# EAGLE schematic HenHouseController (EAGLE 8.0.2)
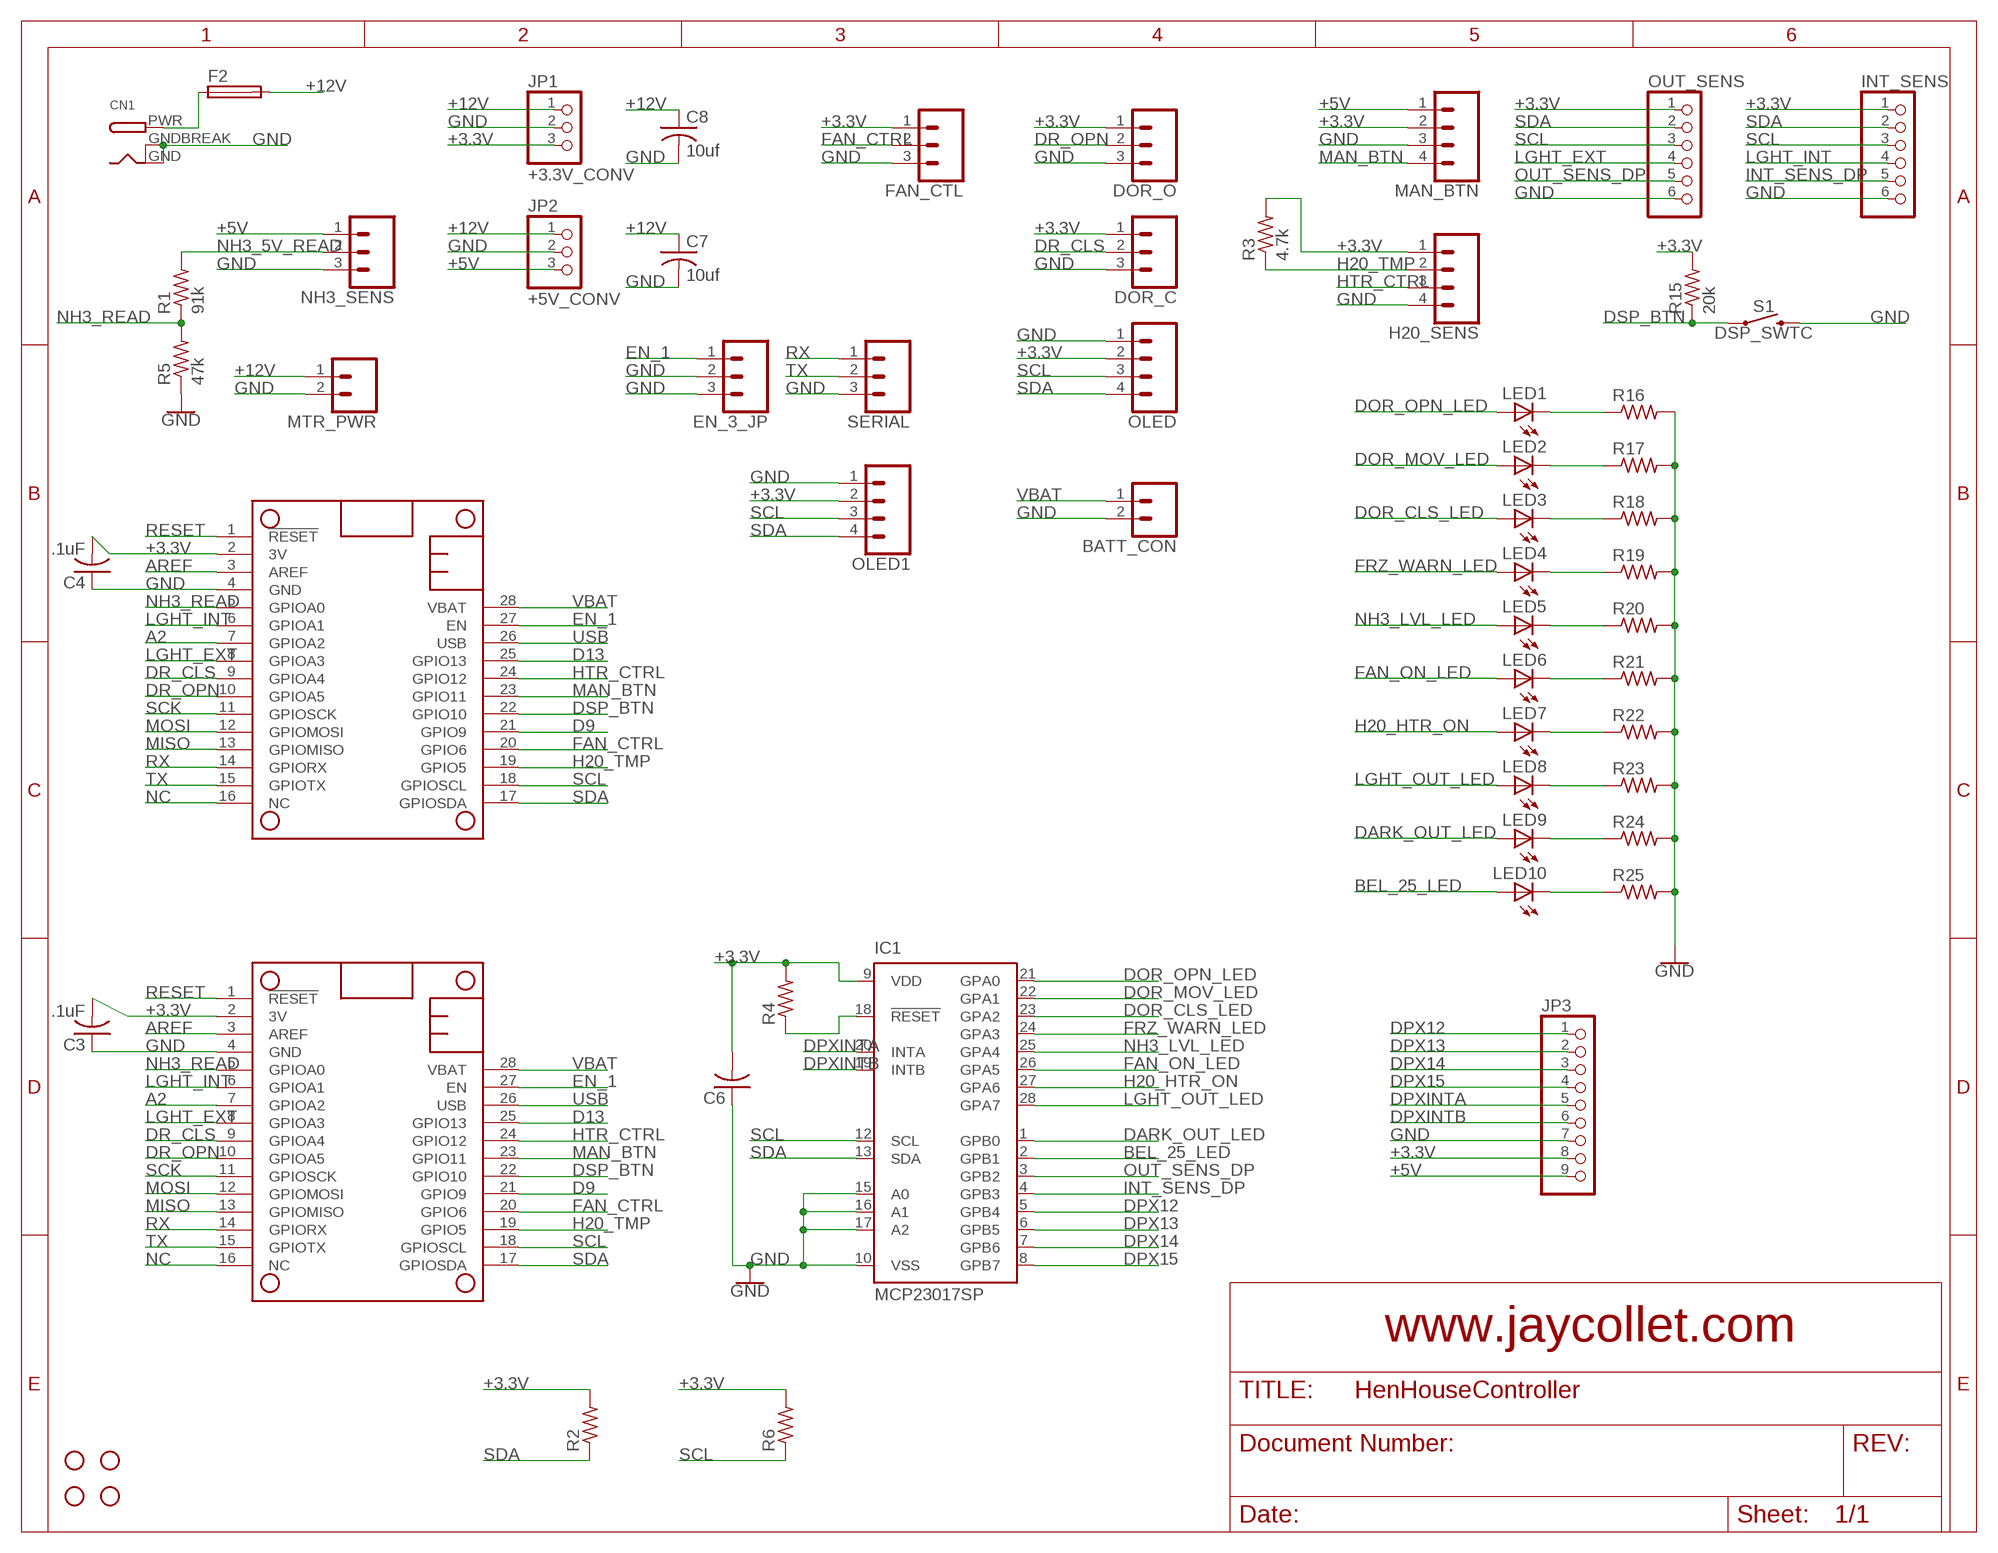
[diagram p0: schematic, sheet 1]

## Parts
BATT_CON  CONN_02  [1X02]
C3  .1uF  C-USC0805  [C0805]
C4  .1uF  C-USC0805  [C0805]
C6  C-USC0805  [C0805]
C7  10uf  C-USC0805  [C0805]
C8  10uf  C-USC0805  [C0805]
CN1  DCBARRELPTH  [DCJACK_2MM_PTH]
DOR_C  CONN_03  [1X03]
DOR_O  CONN_03  [1X03]
EN_3_JP  CONN_03  [1X03]
F2  SH25  [SH25]
FAN_CTL  CONN_03  [1X03]
FEATHER_1  FEATHERWING_NODIM  [FEATHERWING_DIM]
FEATHER_2  FEATHERWING_NODIM  [FEATHERWING_DIM]
H1  STAND-OFF  [STAND-OFF]
H2  STAND-OFF  [STAND-OFF]
H3  STAND-OFF  [STAND-OFF]
H4  STAND-OFF  [STAND-OFF]
H20_SENS  CONN_04  [1X04]
IC1  MCP23017SP  [DIL28-3]
INT_SENS  PINHD-1X6  [1X06]
JP1  +3.3V_CONV  PINHD-1X3  [1X03]
JP2  +5V_CONV  PINHD-1X3  [1X03]
JP3  PINHD-1X9  [1X09-BIG]
LED1  LEDCHIPLED_0805  [CHIPLED_0805]
LED2  LEDCHIPLED_0805  [CHIPLED_0805]
LED3  LEDCHIPLED_0805  [CHIPLED_0805]
LED4  LEDCHIPLED_0805  [CHIPLED_0805]
LED5  LEDCHIPLED_0805  [CHIPLED_0805]
LED6  LEDCHIPLED_0805  [CHIPLED_0805]
LED7  LEDCHIPLED_0805  [CHIPLED_0805]
LED8  LEDCHIPLED_0805  [CHIPLED_0805]
LED9  LEDCHIPLED_0805  [CHIPLED_0805]
LED10  LEDCHIPLED_0805  [CHIPLED_0805]
MAN_BTN  CONN_04  [1X04]
MTR_PWR  CONN_02  [1X02]
NH3_SENS  CONN_03  [1X03]
OLED  CONN_04  [1X04]
OLED1  CONN_04  [1X04]
OUT_SENS  PINHD-1X6  [1X06]
R1  91k  R-US_R0805  [R0805]
R2  R-US_M0805  [M0805]
R3  4.7k  R-US_R0805  [R0805]
R4  R-US_R0805  [R0805]
R5  47k  R-US_R0805  [R0805]
R6  R-US_M0805  [M0805]
R15  20k  R-US_M0805  [M0805]
R16  R-US_R0805  [R0805]
R17  R-US_R0805  [R0805]
R18  R-US_R0805  [R0805]
R19  R-US_R0805  [R0805]
R20  R-US_R0805  [R0805]
R21  R-US_R0805  [R0805]
R22  R-US_R0805  [R0805]
R23  R-US_R0805  [R0805]
R24  R-US_R0805  [R0805]
R25  R-US_R0805  [R0805]
S1  DSP_SWTC  MOMENTARY-SWITCH-SPST-PTH-6.0MM  [TACTILE_SWITCH_PTH_6.0MM]
SERIAL  CONN_03  [1X03]

## Nets
+3.3V: C3.2 C4.2 C6.2 DOR_C.1 DOR_O.1 FAN_CTL.1 FEATHER_1.2(3V) FEATHER_2.2(3V) H20_SENS.1 IC1.9(VDD) INT_SENS.1 JP1.3 JP3.8 MAN_BTN.2 OLED1.2 OLED.2 OUT_SENS.1 R2.2 R3.2 R4.2 R6.2 R15.2
+5V [+5V]: JP2.3 JP3.9 MAN_BTN.1 NH3_SENS.1
+12V [+12V]: C7.1 C8.1 F2.2 JP1.1 JP2.1 MTR_PWR.1
A2: FEATHER_1.7(GPIOA2) FEATHER_2.7(GPIOA2)
AREF: FEATHER_1.3(AREF) FEATHER_2.3(AREF)
BEL_25_LED: IC1.2(GPB1) LED10.A
D9: FEATHER_1.21(GPIO9) FEATHER_2.21(GPIO9)
D13: FEATHER_1.25(GPIO13) FEATHER_2.25(GPIO13)
DARK_OUT_LED: IC1.1(GPB0) LED9.A
DOR_CLS_LED: IC1.23(GPA2) LED3.A
DOR_MOV_LED: IC1.22(GPA1) LED2.A
DOR_OPN_LED: IC1.21(GPA0) LED1.A
DPX12: IC1.5(GPB4) JP3.1
DPX13: IC1.6(GPB5) JP3.2
DPX14: IC1.7(GPB6) JP3.3
DPX15: IC1.8(GPB7) JP3.4
DPXINTA: IC1.20(INTA) JP3.5
DPXINTB: IC1.19(INTB) JP3.6
DR_CLS: DOR_C.2 FEATHER_1.9(GPIOA4) FEATHER_2.9(GPIOA4)
DR_OPN: DOR_O.2 FEATHER_1.10(GPIOA5) FEATHER_2.10(GPIOA5)
DSP_BTN: FEATHER_1.22(GPIO10) FEATHER_2.22(GPIO10) R15.1 S1.1
EN_1: EN_3_JP.1 FEATHER_1.27(EN) FEATHER_2.27(EN)
FAN_CTRL: FAN_CTL.2 FEATHER_1.20(GPIO6) FEATHER_2.20(GPIO6)
FAN_ON_LED: IC1.26(GPA5) LED6.A
FRZ_WARN_LED: IC1.24(GPA3) LED4.A
GND: BATT_CON.2 C3.1 C4.1 C6.1 C7.2 C8.2 CN1.GND CN1.GNDBREAK DOR_C.3 DOR_O.3 EN_3_JP.2 EN_3_JP.3 FAN_CTL.3 FEATHER_1.4(GND) FEATHER_2.4(GND) H20_SENS.4 IC1.10(VSS) IC1.15(A0) IC1.16(A1) IC1.17(A2) INT_SENS.6 JP1.2 JP2.2 JP3.7 MAN_BTN.3 MTR_PWR.2 NH3_SENS.3 OLED1.1 OLED.1 OUT_SENS.6 R5.1 R16.2 R17.2 R18.2 R19.2 R20.2 R21.2 R22.2 R23.2 R24.2 R25.2 S1.3 SERIAL.3
H20_HTR_ON: IC1.27(GPA6) LED7.A
H20_TMP: FEATHER_1.19(GPIO5) FEATHER_2.19(GPIO5) H20_SENS.2 R3.1
HTR_CTRL: FEATHER_1.24(GPIO12) FEATHER_2.24(GPIO12) H20_SENS.3
INT_SENS_DP: IC1.4(GPB3) INT_SENS.5
LGHT_EXT: FEATHER_1.8(GPIOA3) FEATHER_2.8(GPIOA3) OUT_SENS.4
LGHT_INT: FEATHER_1.6(GPIOA1) FEATHER_2.6(GPIOA1) INT_SENS.4
LGHT_OUT_LED: IC1.28(GPA7) LED8.A
MAN_BTN: FEATHER_1.23(GPIO11) FEATHER_2.23(GPIO11) MAN_BTN.4
MISO: FEATHER_1.13(GPIOMISO) FEATHER_2.13(GPIOMISO)
MOSI: FEATHER_1.12(GPIOMOSI) FEATHER_2.12(GPIOMOSI)
N$1 [+12V]: CN1.PWR F2.1
N$2: IC1.18(!RESET) R4.1
N$9: LED1.C R16.1
N$11: LED2.C R17.1
N$13: LED3.C R18.1
N$15: LED4.C R19.1
N$16: LED5.C R20.1
N$17: LED6.C R21.1
N$18: LED7.C R22.1
N$19: LED8.C R23.1
N$20: LED9.C R24.1
N$21: LED10.C R25.1
NC: FEATHER_1.16(NC) FEATHER_2.16(NC)
NH3_5V_READ: NH3_SENS.2 R1.2
NH3_LVL_LED: IC1.25(GPA4) LED5.A
NH3_READ: FEATHER_1.5(GPIOA0) FEATHER_2.5(GPIOA0) R1.1 R5.2
OUT_SENS_DP: IC1.3(GPB2) OUT_SENS.5
RESET: FEATHER_1.1(!RESET) FEATHER_2.1(!RESET)
RX: FEATHER_1.14(GPIORX) FEATHER_2.14(GPIORX) SERIAL.1
SCK: FEATHER_1.11(GPIOSCK) FEATHER_2.11(GPIOSCK)
SCL: FEATHER_1.18(GPIOSCL) FEATHER_2.18(GPIOSCL) IC1.12(SCL) INT_SENS.3 OLED1.3 OLED.3 OUT_SENS.3 R6.1
SDA: FEATHER_1.17(GPIOSDA) FEATHER_2.17(GPIOSDA) IC1.13(SDA) INT_SENS.2 OLED1.4 OLED.4 OUT_SENS.2 R2.1
TX: FEATHER_1.15(GPIOTX) FEATHER_2.15(GPIOTX) SERIAL.2
USB: FEATHER_1.26(USB) FEATHER_2.26(USB)
VBAT: BATT_CON.1 FEATHER_1.28(VBAT) FEATHER_2.28(VBAT)

## Notes on the sheet
- www.jaycollet.com

## Library data of the parts
BATT_CON MTR_PWR = SparkFun-Connectors:CONN_02: Multi connection point. Often used as Generic Header-pin footprint for 0.1 inch spaced/style header connections On any of the 0.1 inch spaced packages, you can populate with these: Break Away Headers - Straight <https://www.sparkfun.com/products/116> (PRT-00116) Break Away Male Headers - Right Angle <https://www.sparkfun.com/products/553> (PRT-00553) Female Headers <https://www.sparkfun.com/products/115> (PRT-00115) Break Away Headers - Machine Pin <https://www.sparkfun.com/products/117> (PRT-00117) Break Away Female Headers - Swiss Machine Pin <https://www.sparkfun.com/products/743> (PRT-00743) For SCREWTERMINALS and SPRING TERMINALS visit here: Screw Terimnals on SparkFun.com <https://www.sparkfun.com/search/results?term=Screw+Terminals> (5mm/3.5mm/2.54mm spacing) This device is also useful as a general connection point to wire up your design to another part of your project. Our various solder wires solder well into these plated through hole pads. Hook-Up Wire - Assortment (Stranded, 22 AWG) <https://www.sparkfun.com/products/11375> (PRT-11375) Hook-Up Wire - Assortment (Solid Core, 22 AWG) <https://www.sparkfun.com/products/11367> (PRT-11367) View the entire wire category on our website here <https://www.sparkfun.com/categories/141> Special notes: Molex polarized connector foot print use with: PRT-08233 with associated crimp pins and housings. 2.54_SCREWTERM for use with PRT-10571. 3.5mm Screw Terminal footprints for PRT-08084 5mm Screw Terminal footprints for use with PRT-08432
C3 C4 C6-C8 = adafruit:C-US: CAPACITOR, American symbol
CN1 = adafruit:DCBARREL: 2.0mm DC Barrel Jack DCJACK_2MM_PTH - Through Hole Jack (4UConnector: 05537)
DOR_C DOR_O EN_3_JP FAN_CTL NH3_SENS SERIAL = SparkFun-Connectors:CONN_03: Multi connection point. Often used as Generic Header-pin footprint for 0.1 inch spaced/style header connections On any of the 0.1 inch spaced packages, you can populate with these: Break Away Headers - Straight <https://www.sparkfun.com/products/116> (PRT-00116) Break Away Male Headers - Right Angle <https://www.sparkfun.com/products/553> (PRT-00553) Female Headers <https://www.sparkfun.com/products/115> (PRT-00115) Break Away Headers - Machine Pin <https://www.sparkfun.com/products/117> (PRT-00117) Break Away Female Headers - Swiss Machine Pin <https://www.sparkfun.com/products/743> (PRT-00743) Stackable Header - 3 Pin (Female, 0.1") <https://www.sparkfun.com/products/13875> (PRT-13875) For SCREWTERMINALS and SPRING TERMINALS visit here: Screw Terimnals on SparkFun.com <https://www.sparkfun.com/search/results?term=Screw+Terminals> (5mm/3.5mm/2.54mm spacing) This device is also useful as a general connection point to wire up your design to another part of your project. Our various solder wires solder well into these plated through hole pads. Hook-Up Wire - Assortment (Stranded, 22 AWG) <https://www.sparkfun.com/products/11375> (PRT-11375) Hook-Up Wire - Assortment (Solid Core, 22 AWG) <https://www.sparkfun.com/products/11367> (PRT-11367) View the entire wire category on our website here <https://www.sparkfun.com/categories/141> Special notes: Molex polarized connector foot print use with SKU : PRT-08232 with associated crimp pins and housings.
F2 = fuse:SH25: FUSE HOLDER grid 25 mm, OGN0031 8211, Schurter (Buerklin); MF: SCHURTER; MPN: 0031.8211; OC_FARNELL: 1162741; OC_NEWARK: 96B9380
FEATHER_1 FEATHER_2 = adafruit:FEATHERWING
H1-H4 = SparkFun-Hardware:STAND-OFF: Stand Off Drill holes for mechanically mounting via screws, standoffs, etc. Note: Use the keepout ring to avoid running the screw head into surrounding components. Variant Overviews STAND-OFF - Mechanical footprint for a #4 phillips button head screw. STAND-OFF-TIGHT - Mechanical footprint for a #4 phillips button head screw, Example SparkFun Products Screw - Phillips Head (1/4", 4-40, 10 pack) <https://www.sparkfun.com/products/10453> (PRT-10453) Screw - Phillips Head (1/2", 4-40, 10 pack) <https://www.sparkfun.com/products/10452> (PRT-10452) Screw - Phillips Head (3/4", 4-40, 10 pack) <https://www.sparkfun.com/products/10451> (PRT-10451) Screw - Phillips Head (1", 4-40, 10 pack) <https://www.sparkfun.com/products/10450> (PRT-10450)
H20_SENS MAN_BTN OLED OLED1 = SparkFun-Connectors:CONN_04: Multi connection point. Often used as Generic Header-pin footprint for 0.1 inch spaced/style header connections On any of the 0.1 inch spaced packages, you can populate with these: Break Away Headers - Straight <https://www.sparkfun.com/products/116> (PRT-00116) Break Away Male Headers - Right Angle <https://www.sparkfun.com/products/553> (PRT-00553) Female Headers <https://www.sparkfun.com/products/115> (PRT-00115) Break Away Headers - Machine Pin <https://www.sparkfun.com/products/117> (PRT-00117) Break Away Female Headers - Swiss Machine Pin <https://www.sparkfun.com/products/743> (PRT-00743) For SCREWTERMINALS and SPRING TERMINALS visit here: Screw Terimnals on SparkFun.com <https://www.sparkfun.com/search/results?term=Screw+Terminals> (5mm/3.5mm/2.54mm spacing) This device is also useful as a general connection point to wire up your design to another part of your project. Our various solder wires solder well into these plated through hole pads. Hook-Up Wire - Assortment (Stranded, 22 AWG) <https://www.sparkfun.com/products/11375> (PRT-11375) Hook-Up Wire - Assortment (Solid Core, 22 AWG) <https://www.sparkfun.com/products/11367> (PRT-11367) View the entire wire category on our website here <https://www.sparkfun.com/categories/141> Special notes: Molex polarized connector foot print use with SKU : PRT-08231 with associated crimp pins and housings. 1MM SMD Version SKU: PRT-10208; PROD_ID: CONN-09696
IC1 = adafruit:MCP23017: http://ww1.microchip.com/downloads/en/DeviceDoc/21952a.pdf Source: http://ww1.microchip.com/downloads/en/DeviceDoc/21952a.pdf
INT_SENS OUT_SENS = adafruit:PINHD-1X6: PIN HEADER
JP1 JP2 = adafruit:PINHD-1X3: PIN HEADER
JP3 = adafruit:PINHD-1X9: Pin header 1x10 0.1" spacing With round pins
LED1-LED10 = adafruit:LED: LED OSRAM: - CHIPLED LG R971, LG N971, LY N971, LG Q971, LY Q971, LO R971, LY R971 LH N974, LH R974 LS Q976, LO Q976, LY Q976 LO Q996 - Hyper CHIPLED LW Q18S LB Q993, LB Q99A, LB R99A - SideLED LS A670, LO A670, LY A670, LG A670, LP A670 LB A673, LV A673, LT A673, LW A673 LH A674 LY A675 LS A676, LA A676, LO A676, LY A676, LW A676 LS A679, LY A679, LG A679 - Hyper Micro SIDELED® LS Y876, LA Y876, LO Y876, LY Y876 LT Y87S - SmartLED LW L88C, LW L88S LB L89C, LB L89S, LG L890 LS L89K, LO L89K, LY L89K LS L896, LA L896, LO L896, LY L896 - TOPLED LS T670, LO T670, LY T670, LG T670, LP T670 LSG T670, LSP T670, LSY T670, LOP T670, LYG T670 LG T671, LOG T671, LSG T671 LB T673, LV T673, LT T673, LW T673 LH T674 LS T676, LA T676, LO T676, LY T676, LB T676, LH T676, LSB T676, LW T676 LB T67C, LV T67C, LT T67C, LS T67K, LO T67K, LY T67K, LW E67C LS E67B, LA E67B, LO E67B, LY E67B, LB E67C, LV E67C, LT E67C LW T67C LS T679, LY T679, LG T679 LS T770, LO T770, LY T770, LG T770, LP T770 LB T773, LV T773, LT T773, LW T773 LH T774 LS E675, LA E675, LY E675, LS T675 LS T776, LA T776, LO T776, LY T776, LB T776 LHGB T686 LT T68C, LB T68C - Hyper Mini TOPLED® LB M676 - Mini TOPLED Santana® LG M470 LS M47K, LO M47K, LY M47K Source: http://www.osram.convergy.de/
R1-R6 R15-R25 = adafruit:R-US_: RESISTOR, American symbol
S1 = SparkFun-Switches:MOMENTARY-SWITCH-SPST: Momentary Switch (Pushbutton) - SPST Normally-open (NO) SPST momentary switches (buttons, pushbuttons). Variants PTH-12MM - 12mm square, through-hole Momentary Pushbutton Switch - 12mm Square <https://www.sparkfun.com/products/9190> (COM-09190) PTH-6.0MM, PTH-6.0MM-KIT - 6.0mm square, through-hole Mini Pushbutton Switch <https://www.sparkfun.com/products/97> (COM-00097) KIT package intended for soldering kit's - only one side of pads' copper is exposed. PTH-RIGHT-ANGLE-KIT - Right-angle, through-hole Right Angle Tactile Button <https://www.sparkfun.com/products/10791> - Used on SparkFun BigTime Watch Kit <https://www.sparkfun.com/products/11734> SMD-12MM - 12mm square, surface-mount Tactile Button - SMD (12mm) <https://www.sparkfun.com/products/12993> (COM-12993) Used on SparkFun PicoBoard <https://www.sparkfun.com/products/11888> SMD-4.5MM - 4.5mm Square Trackball Switch Used on SparkFun Blackberry Trackballer Breakout <https://www.sparkfun.com/products/13169> SMD-4.6MMX2.8MM - 4.60mm x 2.80mm, surface mount Used on SparkFun SAMD21 Mini Breakout <https://www.sparkfun.com/products/13664> SMD-5.2MM, SMD-5.2-REDUNDANT - 5.2mm square, surface-mount Mini Pushbutton Switch - SMD <https://www.sparkfun.com/products/8720> (COM-08720) Used on Arduino Pro Mini <https://www.sparkfun.com/products/11114> REDUNDANT package connects both switch circuits together SMD-6.0X3.5MM - 6.0 x 3.5mm, surface mount Momentary Reset Switch SMD <https://www.sparkfun.com/products/8229> (COM-08229) SMD-6.2MM-TALL - 6.2mm square, surface mount Tactile Button - SMD (6mm) <https://www.sparkfun.com/products/12992> Used on SparkFun Digital Sandbox <https://www.sparkfun.com/products/12651> SMD-RIGHT-ANGLE - Right-angle, surface mount Used on SparkFun Block for Intel® Edison - Arduino <https://www.sparkfun.com/products/13036>; PROD_ID: SWCH-08441; SF_SKU: COM-00097

## Net classes
0 default: width 0.254 mm, clearance 0.305 mm
1 +12V: width 0.889 mm, clearance 0.381 mm
2 motor: width 0.635 mm, clearance 0.381 mm
3 +5V: width 0.381 mm, clearance 0.381 mm